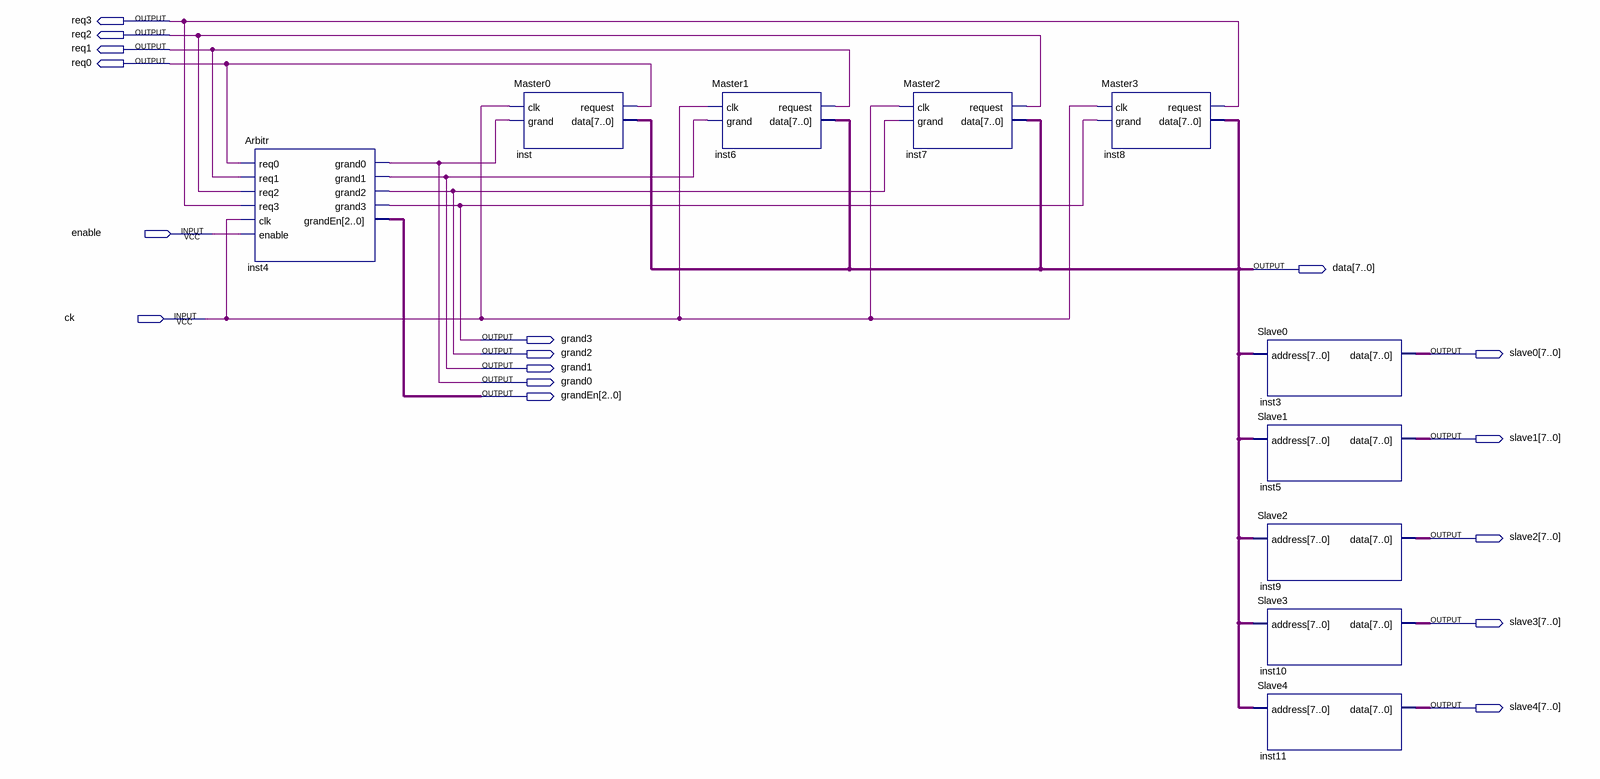
[diagram p0: schematic sheet]
// Quartus schematic Main.bdf as structural Verilog: 10 symbols, 17 pins
module Main (
  input  enable,
  input  ck,
  output req3,
  output req2,
  output req1,
  output req0,
  output [7:0] data,
  output grand3,
  output grand2,
  output [7:0] slave0,
  output grand1,
  output grand0,
  output [2:0] grandEn,
  output [7:0] slave1,
  output [7:0] slave2,
  output [7:0] slave3,
  output [7:0] slave4
);

  Arbitr inst4 (
    .req0(req0), .req1(req1), .req2(req2), .req3(req3), .clk(ck), .enable(enable), .grand0(grand0),
    .grand1(grand1), .grand2(grand2), .grand3(grand3), .grandEn(grandEn));
  Master0 inst (.clk(ck), .grand(grand0), .request(req0), .data(data));
  Master1 inst6 (.clk(ck), .grand(grand1), .request(req1), .data(data));
  Master2 inst7 (.clk(ck), .grand(grand2), .request(req2), .data(data));
  Master3 inst8 (.clk(ck), .grand(grand3), .request(req3), .data(data));
  Slave0 inst3 (.address(data), .data(slave0));
  Slave1 inst5 (.address(data), .data(slave1));
  Slave2 inst9 (.address(data), .data(slave2));
  Slave3 inst10 (.address(data), .data(slave3));
  Slave4 inst11 (.address(data), .data(slave4));
endmodule
